# EasyEDA schematic SCH_SHOC.json
TITLE: SHOC; REV: 1.1; Date: 2022-07-12; Sheet: 1/1; Drawn By: JannikB5825; Company: dumb inc.
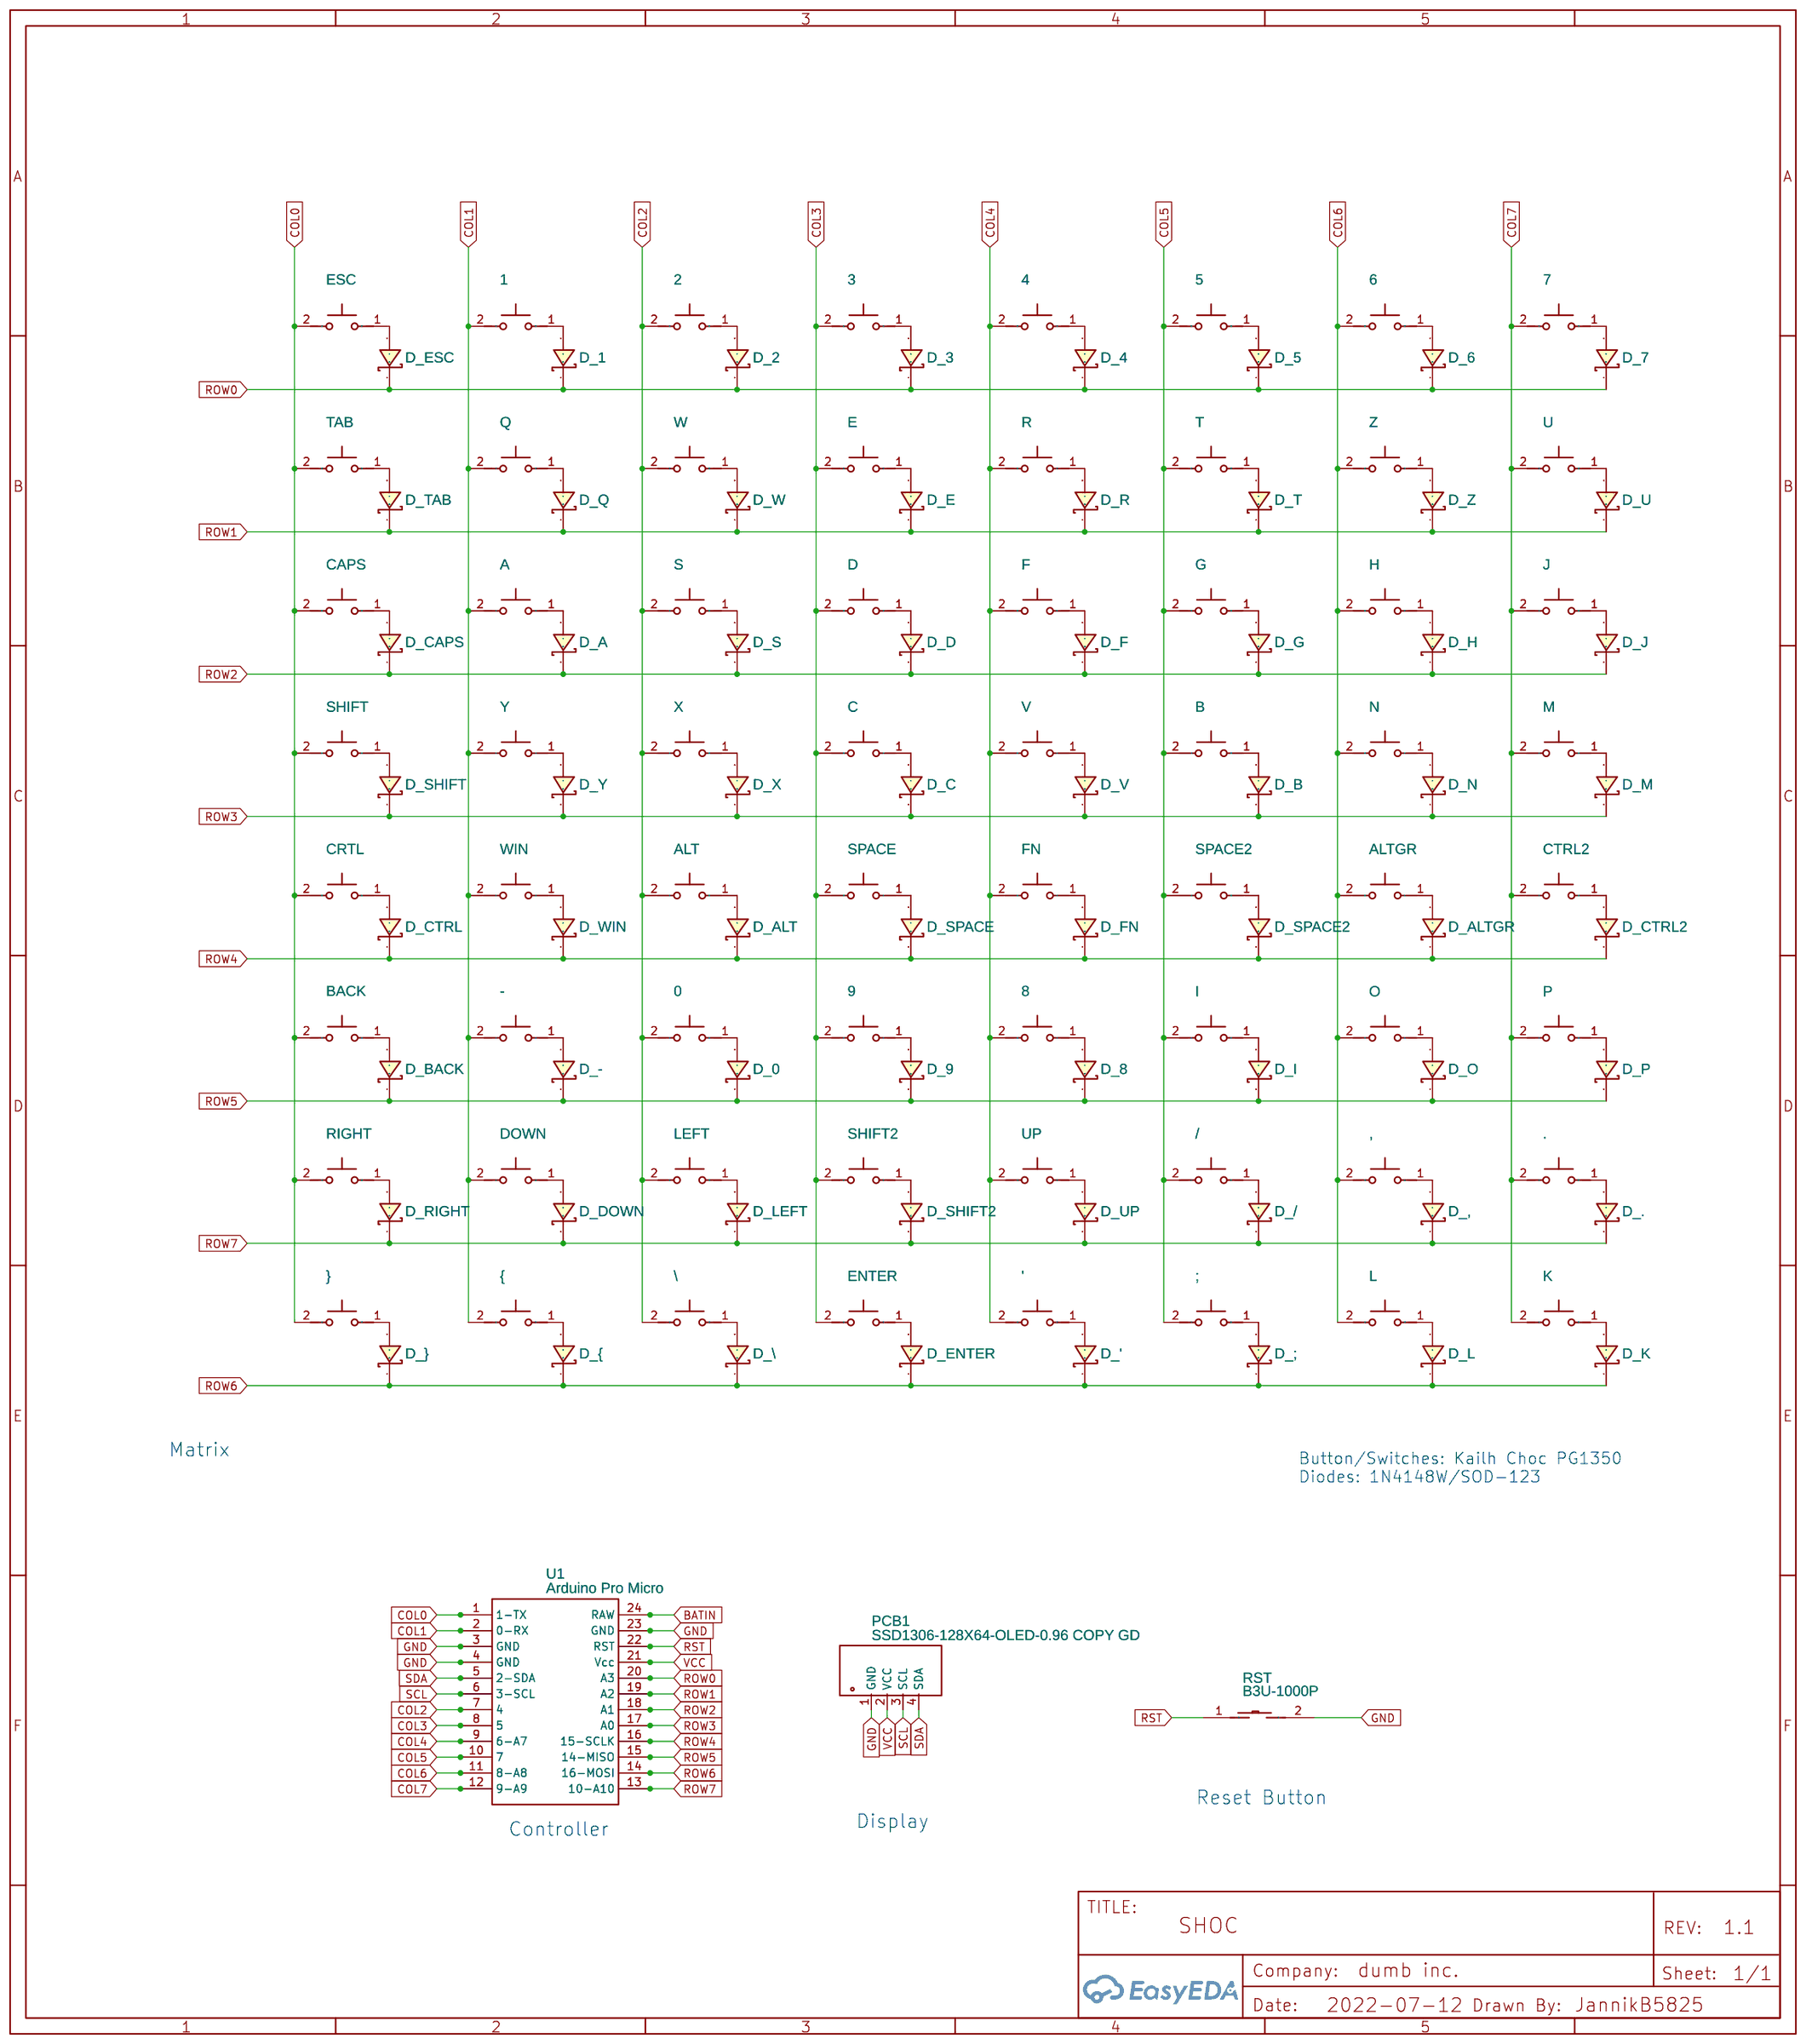
[diagram p0: schematic sheet]

## Parts
0  PG1350  [CHOC_PG1350_CHOC_SPACING_REVERSIBLE]
1  PG1350  [CHOC_PG1350_CHOC_SPACING_REVERSIBLE]
2  PG1350  [CHOC_PG1350_CHOC_SPACING_REVERSIBLE]
3  PG1350  [CHOC_PG1350_CHOC_SPACING_REVERSIBLE]
4  PG1350  [CHOC_PG1350_CHOC_SPACING_REVERSIBLE]
5  PG1350  [CHOC_PG1350_CHOC_SPACING_REVERSIBLE]
6  PG1350  [CHOC_PG1350_CHOC_SPACING_REVERSIBLE]
7  PG1350  [CHOC_PG1350_CHOC_SPACING_REVERSIBLE]
8  PG1350  [CHOC_PG1350_CHOC_SPACING_REVERSIBLE]
9  PG1350  [CHOC_PG1350_CHOC_SPACING_REVERSIBLE]
'  PG1350  [CHOC_PG1350_CHOC_SPACING_REVERSIBLE]
,  PG1350  [CHOC_PG1350_CHOC_SPACING_REVERSIBLE]
-  PG1350  [CHOC_PG1350_CHOC_SPACING_REVERSIBLE]
.  PG1350  [CHOC_PG1350_CHOC_SPACING_REVERSIBLE]
/  PG1350  [CHOC_PG1350_CHOC_SPACING_REVERSIBLE]
;  PG1350  [CHOC_PG1350_CHOC_SPACING_REVERSIBLE]
\  PG1350  [CHOC_PG1350_CHOC_SPACING_REVERSIBLE]
A  PG1350  [CHOC_PG1350_CHOC_SPACING_REVERSIBLE]
ALT  PG1350  [CHOC_PG1350_CHOC_SPACING_REVERSIBLE]
ALTGR  PG1350  [CHOC_PG1350_CHOC_SPACING_REVERSIBLE]
B  PG1350  [CHOC_PG1350_CHOC_SPACING_REVERSIBLE]
BACK  PG1350  [CHOC_PG1350_CHOC_SPACING_REVERSIBLE]
C  PG1350  [CHOC_PG1350_CHOC_SPACING_REVERSIBLE]
CAPS  PG1350  [CHOC_PG1350_CHOC_SPACING_REVERSIBLE]
CRTL  PG1350  [CHOC_PG1350_CHOC_SPACING_REVERSIBLE]
CTRL2  PG1350  [CHOC_PG1350_CHOC_SPACING_REVERSIBLE]
D  PG1350  [CHOC_PG1350_CHOC_SPACING_REVERSIBLE]
D_0  MBR2H200SFT3G  [SOD-123FL]
D_1  MBR2H200SFT3G  [SOD-123FL]
D_2  MBR2H200SFT3G  [SOD-123FL]
D_3  MBR2H200SFT3G  [SOD-123FL]
D_4  MBR2H200SFT3G  [SOD-123FL]
D_5  MBR2H200SFT3G  [SOD-123FL]
D_6  MBR2H200SFT3G  [SOD-123FL]
D_7  MBR2H200SFT3G  [SOD-123FL]
D_8  MBR2H200SFT3G  [SOD-123FL]
D_9  MBR2H200SFT3G  [SOD-123FL]
D_'  MBR2H200SFT3G  [SOD-123FL]
D_,  MBR2H200SFT3G  [SOD-123FL]
D_-  MBR2H200SFT3G  [SOD-123FL]
D_.  MBR2H200SFT3G  [SOD-123FL]
D_/  MBR2H200SFT3G  [SOD-123FL]
D_;  MBR2H200SFT3G  [SOD-123FL]
D_\  MBR2H200SFT3G  [SOD-123FL]
D_A  MBR2H200SFT3G  [SOD-123FL]
D_ALT  MBR2H200SFT3G  [SOD-123FL]
D_ALTGR  MBR2H200SFT3G  [SOD-123FL]
D_B  MBR2H200SFT3G  [SOD-123FL]
D_BACK  MBR2H200SFT3G  [SOD-123FL]
D_C  MBR2H200SFT3G  [SOD-123FL]
D_CAPS  MBR2H200SFT3G  [SOD-123FL]
D_CTRL  MBR2H200SFT3G  [SOD-123FL]
D_CTRL2  MBR2H200SFT3G  [SOD-123FL]
D_D  MBR2H200SFT3G  [SOD-123FL]
D_DOWN  MBR2H200SFT3G  [SOD-123FL]
D_E  MBR2H200SFT3G  [SOD-123FL]
D_ENTER  MBR2H200SFT3G  [SOD-123FL]
D_ESC  MBR2H200SFT3G  [SOD-123FL]
D_F  MBR2H200SFT3G  [SOD-123FL]
D_FN  MBR2H200SFT3G  [SOD-123FL]
D_G  MBR2H200SFT3G  [SOD-123FL]
D_H  MBR2H200SFT3G  [SOD-123FL]
D_I  MBR2H200SFT3G  [SOD-123FL]
D_J  MBR2H200SFT3G  [SOD-123FL]
D_K  MBR2H200SFT3G  [SOD-123FL]
D_L  MBR2H200SFT3G  [SOD-123FL]
D_LEFT  MBR2H200SFT3G  [SOD-123FL]
D_M  MBR2H200SFT3G  [SOD-123FL]
D_N  MBR2H200SFT3G  [SOD-123FL]
D_O  MBR2H200SFT3G  [SOD-123FL]
D_P  MBR2H200SFT3G  [SOD-123FL]
D_Q  MBR2H200SFT3G  [SOD-123FL]
D_R  MBR2H200SFT3G  [SOD-123FL]
D_RIGHT  MBR2H200SFT3G  [SOD-123FL]
D_S  MBR2H200SFT3G  [SOD-123FL]
D_SHIFT  MBR2H200SFT3G  [SOD-123FL]
D_SHIFT2  MBR2H200SFT3G  [SOD-123FL]
D_SPACE  MBR2H200SFT3G  [SOD-123FL]
D_SPACE2  MBR2H200SFT3G  [SOD-123FL]
D_T  MBR2H200SFT3G  [SOD-123FL]
D_TAB  MBR2H200SFT3G  [SOD-123FL]
D_U  MBR2H200SFT3G  [SOD-123FL]
D_UP  MBR2H200SFT3G  [SOD-123FL]
D_V  MBR2H200SFT3G  [SOD-123FL]
D_W  MBR2H200SFT3G  [SOD-123FL]
D_WIN  MBR2H200SFT3G  [SOD-123FL]
D_X  MBR2H200SFT3G  [SOD-123FL]
D_Y  MBR2H200SFT3G  [SOD-123FL]
D_Z  MBR2H200SFT3G  [SOD-123FL]
D_{  MBR2H200SFT3G  [SOD-123FL]
D_}  MBR2H200SFT3G  [SOD-123FL]
DOWN  PG1350  [CHOC_PG1350_CHOC_SPACING_REVERSIBLE]
E  PG1350  [CHOC_PG1350_CHOC_SPACING_REVERSIBLE]
ENTER  PG1350  [CHOC_PG1350_CHOC_SPACING_REVERSIBLE]
ESC  PG1350  [CHOC_PG1350_CHOC_SPACING_REVERSIBLE]
F  PG1350  [CHOC_PG1350_CHOC_SPACING_REVERSIBLE]
FN  PG1350  [CHOC_PG1350_CHOC_SPACING_REVERSIBLE]
G  PG1350  [CHOC_PG1350_CHOC_SPACING_REVERSIBLE]
H  PG1350  [CHOC_PG1350_CHOC_SPACING_REVERSIBLE]
I  PG1350  [CHOC_PG1350_CHOC_SPACING_REVERSIBLE]
J  PG1350  [CHOC_PG1350_CHOC_SPACING_REVERSIBLE]
K  PG1350  [CHOC_PG1350_CHOC_SPACING_REVERSIBLE]
L  PG1350  [CHOC_PG1350_CHOC_SPACING_REVERSIBLE]
LEFT  PG1350  [CHOC_PG1350_CHOC_SPACING_REVERSIBLE]
M  PG1350  [CHOC_PG1350_CHOC_SPACING_REVERSIBLE]
N  PG1350  [CHOC_PG1350_CHOC_SPACING_REVERSIBLE]
O  PG1350  [CHOC_PG1350_CHOC_SPACING_REVERSIBLE]
P  PG1350  [CHOC_PG1350_CHOC_SPACING_REVERSIBLE]
PCB1  SSD1306-128X64-OLED-0.96 COPY GD  [SSD1306GD]
Q  PG1350  [CHOC_PG1350_CHOC_SPACING_REVERSIBLE]
R  PG1350  [CHOC_PG1350_CHOC_SPACING_REVERSIBLE]
RIGHT  PG1350  [CHOC_PG1350_CHOC_SPACING_REVERSIBLE]
RST  B3U-1000P  [KEY-SMD_B3U-1000PM]
S  PG1350  [CHOC_PG1350_CHOC_SPACING_REVERSIBLE]
SHIFT  PG1350  [CHOC_PG1350_CHOC_SPACING_REVERSIBLE]
SHIFT2  PG1350  [CHOC_PG1350_CHOC_SPACING_REVERSIBLE]
SPACE  PG1350  [CHOC_PG1350_CHOC_SPACING_REVERSIBLE]
SPACE2  PG1350  [CHOC_PG1350_CHOC_SPACING_REVERSIBLE]
T  PG1350  [CHOC_PG1350_CHOC_SPACING_REVERSIBLE]
TAB  PG1350  [CHOC_PG1350_CHOC_SPACING_REVERSIBLE]
U  PG1350  [CHOC_PG1350_CHOC_SPACING_REVERSIBLE]
U1  Arduino Pro Micro  [ARDUINOPROMICRO]
UP  PG1350  [CHOC_PG1350_CHOC_SPACING_REVERSIBLE]
V  PG1350  [CHOC_PG1350_CHOC_SPACING_REVERSIBLE]
W  PG1350  [CHOC_PG1350_CHOC_SPACING_REVERSIBLE]
WIN  PG1350  [CHOC_PG1350_CHOC_SPACING_REVERSIBLE]
X  PG1350  [CHOC_PG1350_CHOC_SPACING_REVERSIBLE]
Y  PG1350  [CHOC_PG1350_CHOC_SPACING_REVERSIBLE]
Z  PG1350  [CHOC_PG1350_CHOC_SPACING_REVERSIBLE]
{  PG1350  [CHOC_PG1350_CHOC_SPACING_REVERSIBLE]
}  PG1350  [CHOC_PG1350_CHOC_SPACING_REVERSIBLE]

## Library data of the parts
0-9 ' , - . / ; \ A ALT ALTGR B BACK C CAPS CRTL CTRL2 D DOWN E ENTER ESC F FN G H I J K L LEFT M N O P Q R RIGHT S SHIFT SHIFT2 SPACE SPACE2 T TAB U UP V W WIN X Y Z { } = PG1350: Supplier: LCSC; Supplier Part: C400230; Manufacturer: Kailh; Manufacturer Part: CPG135001D02; Contributor: skywalker999u; JLCPCB Part Class: Extended Part
D_0-D_9 D_' D_, D_- D_. D_/ D_; D_\ D_A D_ALT D_ALTGR D_B D_BACK D_C D_CAPS D_CTRL D_CTRL2 D_D D_DOWN D_E D_ENTER D_ESC D_F D_FN D_G D_H D_I D_J D_K D_L D_LEFT D_M D_N D_O D_P D_Q D_R D_RIGHT D_S D_SHIFT D_SHIFT2 D_SPACE D_SPACE2 D_T D_TAB D_U D_UP D_V D_W D_WIN D_X D_Y D_Z D_{ D_} = MBR2H200SFT3G: Supplier: Digi-Key; Supplier Part: MBR2H200SFT3GOSCT-ND; Manufacturer: ON Semiconductor; Contributor: David Connolly; link: https://www.digikey.com/en/products/detail/on-semiconductor/MBR2H200SFT3G/5257128
PCB1 = SSD1306-128X64-OLED-0.96 COPY GD: sourceId: wICUcuL3l; Contributor: GavinD
RST = B3U-1000P: Supplier: LCSC; Supplier Part: C231329; Manufacturer: Omron Electronics; Contributor: LCSC; JLCPCB Part Class: Extended Part
U1 = Arduino Pro Micro: Contributor: DPECHON

## Nets
GND: PCB1.1(GND) RST.2 U1.3(GND) U1.4(GND) U1.23(GND)
VCC: PCB1.2(VCC) U1.21(Vcc)
BATIN: U1.24(RAW)
COL0: BACK.2(1) CAPS.2(1) CRTL.2(1) ESC.2(1) RIGHT.2(1) SHIFT.2(1) TAB.2(1) U1.1(1-TX) }.2(1)
COL1: 1.2(1) -.2(1) A.2(1) DOWN.2(1) Q.2(1) U1.2(0-RX) WIN.2(1) Y.2(1) {.2(1)
COL2: 0.2(1) 2.2(1) \.2(1) ALT.2(1) LEFT.2(1) S.2(1) U1.7(4) W.2(1) X.2(1)
COL3: 3.2(1) 9.2(1) C.2(1) D.2(1) E.2(1) ENTER.2(1) SHIFT2.2(1) SPACE.2(1) U1.8(5)
COL4: 4.2(1) 8.2(1) '.2(1) F.2(1) FN.2(1) R.2(1) U1.9(6-A7) UP.2(1) V.2(1)
COL5: 5.2(1) /.2(1) ;.2(1) B.2(1) G.2(1) I.2(1) SPACE2.2(1) T.2(1) U1.10(7)
COL6: 6.2(1) ,.2(1) ALTGR.2(1) H.2(1) L.2(1) N.2(1) O.2(1) U1.11(8-A8) Z.2(1)
COL7: 7.2(1) ..2(1) CTRL2.2(1) J.2(1) K.2(1) M.2(1) P.2(1) U.2(1) U1.12(9-A9)
ROW0: D_1.1(C) D_2.1(C) D_3.1(C) D_4.1(C) D_5.1(C) D_6.1(C) D_7.1(C) D_ESC.1(C) U1.20(A3)
ROW1: D_E.1(C) D_Q.1(C) D_R.1(C) D_T.1(C) D_TAB.1(C) D_U.1(C) D_W.1(C) D_Z.1(C) U1.19(A2)
ROW2: D_A.1(C) D_CAPS.1(C) D_D.1(C) D_F.1(C) D_G.1(C) D_H.1(C) D_J.1(C) D_S.1(C) U1.18(A1)
ROW3: D_B.1(C) D_C.1(C) D_M.1(C) D_N.1(C) D_SHIFT.1(C) D_V.1(C) D_X.1(C) D_Y.1(C) U1.17(A0)
ROW4: D_ALT.1(C) D_ALTGR.1(C) D_CTRL.1(C) D_CTRL2.1(C) D_FN.1(C) D_SPACE.1(C) D_SPACE2.1(C) D_WIN.1(C) U1.16(15-SCLK)
ROW5: D_0.1(C) D_8.1(C) D_9.1(C) D_-.1(C) D_BACK.1(C) D_I.1(C) D_O.1(C) D_P.1(C) U1.15(14-MISO)
ROW6: D_'.1(C) D_;.1(C) D_\.1(C) D_ENTER.1(C) D_K.1(C) D_L.1(C) D_{.1(C) D_}.1(C) U1.14(16-MOSI)
ROW7: D_,.1(C) D_..1(C) D_/.1(C) D_DOWN.1(C) D_LEFT.1(C) D_RIGHT.1(C) D_SHIFT2.1(C) D_UP.1(C) U1.13(10-A10)
RST: RST.1 U1.22(RST)
SCL: PCB1.3(SCL) U1.6(3-SCL)
SDA: PCB1.4(SDA) U1.5(2-SDA)
Net-(0-1): 0.1(2) D_0.2(A)
Net-(1-1): 1.1(2) D_1.2(A)
Net-(2-1): 2.1(2) D_2.2(A)
Net-(3-1): 3.1(2) D_3.2(A)
Net-(4-1): 4.1(2) D_4.2(A)
Net-(5-1): 5.1(2) D_5.2(A)
Net-(6-1): 6.1(2) D_6.2(A)
Net-(7-1): 7.1(2) D_7.2(A)
Net-(8-1): 8.1(2) D_8.2(A)
Net-(9-1): 9.1(2) D_9.2(A)
Net-('-1): '.1(2) D_'.2(A)
Net-(,-1): ,.1(2) D_,.2(A)
Net-(--1): -.1(2) D_-.2(A)
Net-(.-1): ..1(2) D_..2(A)
Net-(/-1): /.1(2) D_/.2(A)
Net-(;-1): ;.1(2) D_;.2(A)
Net-(\-1): \.1(2) D_\.2(A)
Net-(A-1): A.1(2) D_A.2(A)
Net-(ALT-1): ALT.1(2) D_ALT.2(A)
Net-(ALTGR-1): ALTGR.1(2) D_ALTGR.2(A)
Net-(B-1): B.1(2) D_B.2(A)
Net-(BACK-1): BACK.1(2) D_BACK.2(A)
Net-(C-1): C.1(2) D_C.2(A)
Net-(CAPS-1): CAPS.1(2) D_CAPS.2(A)
Net-(CRTL-1): CRTL.1(2) D_CTRL.2(A)
Net-(CTRL2-1): CTRL2.1(2) D_CTRL2.2(A)
Net-(D-1): D.1(2) D_D.2(A)
Net-(D_DOWN-2): D_DOWN.2(A) DOWN.1(2)
Net-(D_E-2): D_E.2(A) E.1(2)
Net-(D_ENTER-2): D_ENTER.2(A) ENTER.1(2)
Net-(D_ESC-2): D_ESC.2(A) ESC.1(2)
Net-(D_F-2): D_F.2(A) F.1(2)
Net-(D_FN-2): D_FN.2(A) FN.1(2)
Net-(D_G-2): D_G.2(A) G.1(2)
Net-(D_H-2): D_H.2(A) H.1(2)
Net-(D_I-2): D_I.2(A) I.1(2)
Net-(D_J-2): D_J.2(A) J.1(2)
Net-(D_K-2): D_K.2(A) K.1(2)
Net-(D_L-2): D_L.2(A) L.1(2)
Net-(D_LEFT-2): D_LEFT.2(A) LEFT.1(2)
Net-(D_M-2): D_M.2(A) M.1(2)
Net-(D_N-2): D_N.2(A) N.1(2)
Net-(D_O-2): D_O.2(A) O.1(2)
Net-(D_P-2): D_P.2(A) P.1(2)
Net-(D_Q-2): D_Q.2(A) Q.1(2)
Net-(D_R-2): D_R.2(A) R.1(2)
Net-(D_RIGHT-2): D_RIGHT.2(A) RIGHT.1(2)
Net-(D_S-2): D_S.2(A) S.1(2)
Net-(D_SHIFT2-2): D_SHIFT2.2(A) SHIFT2.1(2)
Net-(D_SHIFT-2): D_SHIFT.2(A) SHIFT.1(2)
Net-(D_SPACE2-2): D_SPACE2.2(A) SPACE2.1(2)
Net-(D_SPACE-2): D_SPACE.2(A) SPACE.1(2)
Net-(D_T-2): D_T.2(A) T.1(2)
Net-(D_TAB-2): D_TAB.2(A) TAB.1(2)
Net-(D_U-2): D_U.2(A) U.1(2)
Net-(D_UP-2): D_UP.2(A) UP.1(2)
Net-(D_V-2): D_V.2(A) V.1(2)
Net-(D_W-2): D_W.2(A) W.1(2)
Net-(D_WIN-2): D_WIN.2(A) WIN.1(2)
Net-(D_X-2): D_X.2(A) X.1(2)
Net-(D_Y-2): D_Y.2(A) Y.1(2)
Net-(D_Z-2): D_Z.2(A) Z.1(2)
Net-(D_{-2): D_{.2(A) {.1(2)
Net-(D_}-2): D_}.2(A) }.1(2)

## Notes on the sheet
- Matrix
- Button/Switches: Kailh Choc PG1350
  Diodes: 1N4148W/SOD-123
- Reset Button
- Controller
- Display
